# Altium schematic sheet thermistors-heaters-connectors.SchDoc
size A4
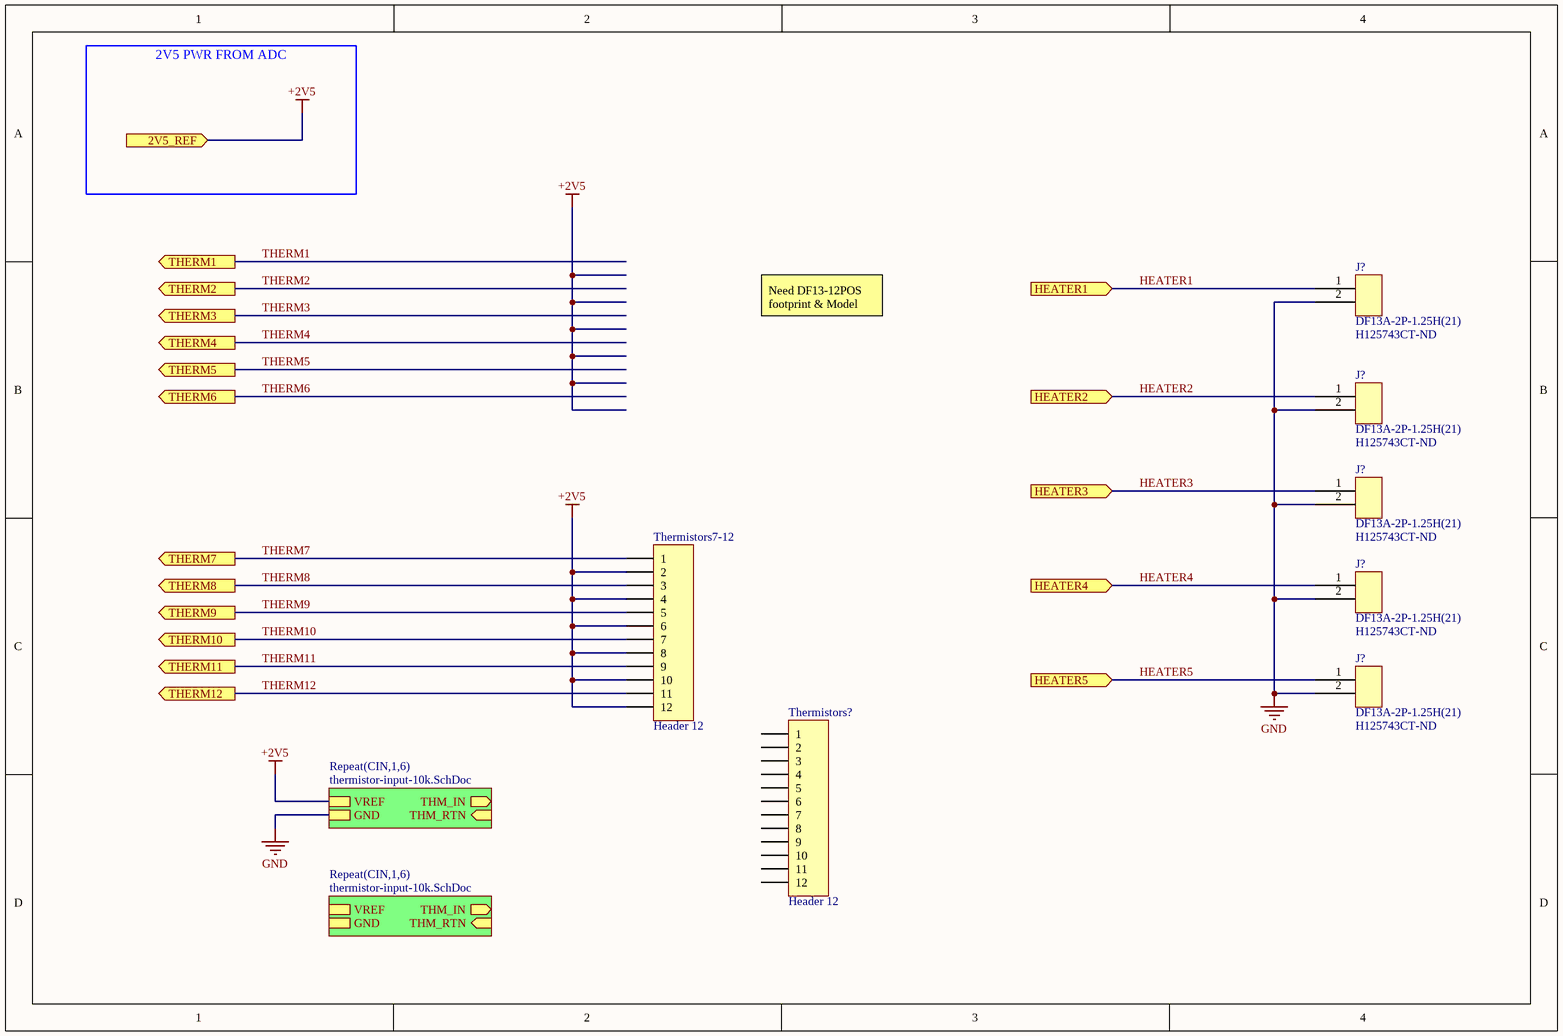
[diagram p0: thermistors-heaters-connectors.SchDoc]

## Parts
(Parts that share a designator on the sheet are numbered #1, #2 ... from top to bottom, then left to right.)
J?#1  DF13A-2P-1.25H(21)  Supplier Part Number 1: H125743CT-ND  [DF13A-2P-1.25H(21)]
J?#2  DF13A-2P-1.25H(21)  Supplier Part Number 1: H125743CT-ND  [DF13A-2P-1.25H(21)]
J?#3  DF13A-2P-1.25H(21)  Supplier Part Number 1: H125743CT-ND  [DF13A-2P-1.25H(21)]
J?#4  DF13A-2P-1.25H(21)  Supplier Part Number 1: H125743CT-ND  [DF13A-2P-1.25H(21)]
J?#5  DF13A-2P-1.25H(21)  Supplier Part Number 1: H125743CT-ND  [DF13A-2P-1.25H(21)]
Thermistors7-12  Header 12  [HDR1X12]
Thermistors?  Header 12  [HDR1X12]

## Sub-sheets
Repeat(CIN,1,6) = thermistor-input-10k.SchDoc: THM_RTN (in), THM_IN (out), GND, VREF
Repeat(CIN,1,6) = thermistor-input-10k.SchDoc: THM_RTN (in), THM_IN (out), GND, VREF

## Ports
2V5_REF (in), HEATER1 (in), HEATER2 (in), HEATER3 (in), HEATER4 (in), HEATER5 (in), THERM1 (out), THERM2 (out), THERM3 (out), THERM4 (out), THERM5 (out), THERM6 (out), THERM7 (out), THERM8 (out), THERM9 (out), THERM10 (out), THERM11 (out), THERM12 (out)

## Nets
+2V5: Thermistors7-12.2 Thermistors7-12.4 Thermistors7-12.6 Thermistors7-12.8 Thermistors7-12.10 Thermistors7-12.12 ; port 2V5_REF, sheet Repeat(CIN,1,6)/VREF
GND: J?#1.2 J?#2.2 J?#3.2 J?#4.2 J?#5.2 ; sheet Repeat(CIN,1,6)/GND
HEATER1: J?#1.1 ; port HEATER1
HEATER2: J?#2.1 ; port HEATER2
HEATER3: J?#3.1 ; port HEATER3
HEATER4: J?#4.1 ; port HEATER4
HEATER5: J?#5.1 ; port HEATER5
THERM1: port THERM1
THERM2: port THERM2
THERM3: port THERM3
THERM4: port THERM4
THERM5: port THERM5
THERM6: port THERM6
THERM7: Thermistors7-12.1 ; port THERM7
THERM8: Thermistors7-12.3 ; port THERM8
THERM9: Thermistors7-12.5 ; port THERM9
THERM10: Thermistors7-12.7 ; port THERM10
THERM11: Thermistors7-12.9 ; port THERM11
THERM12: Thermistors7-12.11 ; port THERM12

Not connected (* = marked no-connect by the designer): Thermistors? 1 2 3 4 5 6 7 8 9 10 11 12

## Notes on the sheet
- 2V5 PWR FROM ADC
- Need DF13-12POS footprint & Model

## Library data of the parts
J?#1-J?#5 = DF13A-2P-1.25H(21): 2 pos DF13 right angle surface mount connector; Supplier 1: Digi-Key
Thermistors7-12 Thermistors? = Header 12: Header, 12-Pin; LatestRevisionDate: 17-Jul-2002; LatestRevisionNote: Re-released for DXP Platform.; Publisher: Altium Limited